# EAGLE design ATDevBoard (EAGLE 7.7.0)
VERSION: 1.1
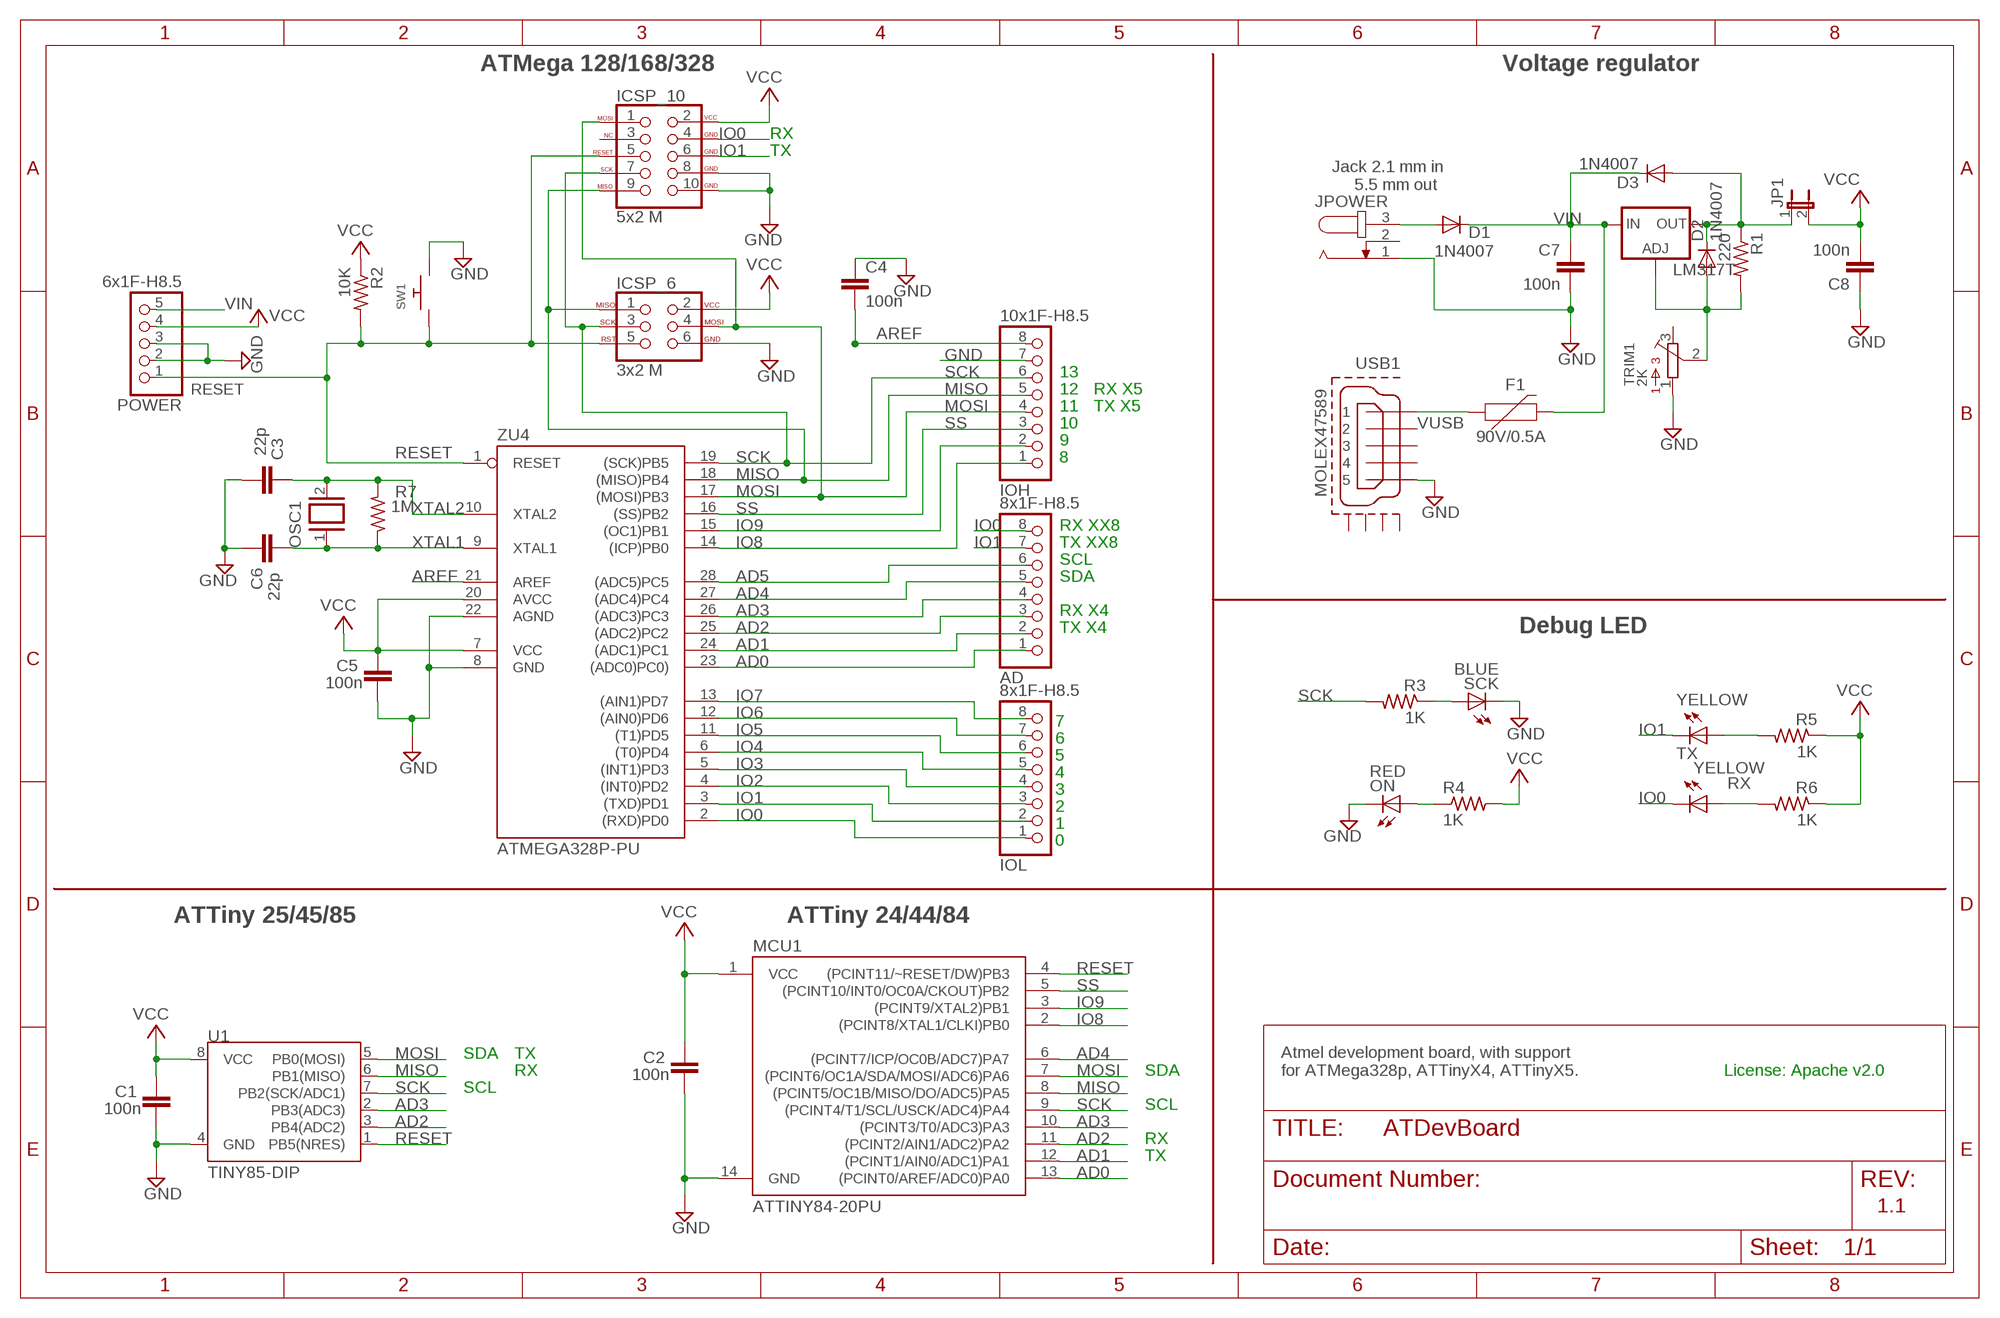
[diagram p0: schematic, sheet 1]

## Parts
AD  8x1F-H8.5  PINHD-1X8  [1X08]
C1  100n  C-EU050-024X044  [C050-024X044]
C2  100n  C-EU050-024X044  [C050-024X044]
C3  22p  C-EU050-024X044  [C050-024X044]
C4  100n  C-EU050-024X044  [C050-024X044]
C5  100n  C-EU050-024X044  [C050-024X044]
C6  22p  C-EU050-024X044  [C050-024X044]
C7  100n  C-EU050-024X044  [C050-024X044]
C8  100n  C-EU050-024X044  [C050-024X044]
D1  1N4007  1N4004  [DO41-10]
D2  1N4007  1N4004  [DO41-10]
D3  1N4007  1N4004  [DO41-10]
F1  90V/0.5A  PPTC_PTH  [PTH]
ICSP_6  3x2 M  AVR_SPI_PROG_3X2PTH  [2X3]
ICSP_10  5x2 M  AVR_SPI_PROG_5X2PTH2  [2X5-SHROUDED]
IOH  10x1F-H8.5  PINHD-1X8  [1X08]
IOL  8x1F-H8.5  PINHD-1X8  [1X08]
JP1  JP1E  [JP1]
JPOWER  JACK-PLUG0  [SPC4077]
LM317T  LM317TS  [317TS]
MCU1  ATTINY84-20PU  ATTINY84ATTINY84-20PU  [DIL14]
ON  RED  LEDCHIPLED_1206  [CHIPLED_1206]
OSC1  XTAL/S  [QS]
POWER  6x1F-H8.5  PINHD-1X5  [1X05]
R1  220  R-US_0204/7  [0204/7]
R2  10K  R-US_0309/12  [0309/12]
R3  1K  R-US_0207/10  [0207/10]
R4  1K  R-US_0207/10  [0207/10]
R5  1K  R-US_0207/10  [0207/10]
R6  1K  R-US_0207/10  [0207/10]
R7  1M  R-US_0309/12  [0309/12]
RX  YELLOW  LEDCHIPLED_1206  [CHIPLED_1206]
SCK  BLUE  LEDCHIPLED_1206  [CHIPLED_1206]
SW1  SWITCH_PUSHBUTTONEVQ-PE  [TACT_PANA-EVQ]
TRIM1  2K  3362R  [3362R]
TX  YELLOW  LEDCHIPLED_1206  [CHIPLED_1206]
U1  TINY85-DIP  ATTINY45TINY85-20-DIP  [DIP08]
USB1  MOLEX47589  MICRO-USB-RECEPTACLE47589-0001  [47589-0001]
ZU4  ATMEGA328P-PU  [DIL28-3]

## Nets
AD0: AD.1 MCU1.13((PCINT0/AREF/ADC0)PA0) ZU4.23((ADC0)PC0))
AD1: AD.2 MCU1.12((PCINT1/AIN0/ADC1)PA1) ZU4.24((ADC1)PC1)
AD2: AD.3 MCU1.11((PCINT2/AIN1/ADC2)PA2) U1.3(PB4(ADC2)) ZU4.25((ADC2)PC2)
AD3: AD.4 MCU1.10((PCINT3/T0/ADC3)PA3) U1.2(PB3(ADC3)) ZU4.26((ADC3)PC3)
AD4: AD.5 MCU1.6((PCINT7/ICP/OC0B/ADC7)PA7) ZU4.27((ADC4)PC4)
AD5: AD.6 ZU4.28((ADC5)PC5)
AREF [aref]: C4.2 IOH.8 ZU4.21(AREF)
GND [gnd]: C1.1 C2.1 C3.1 C4.1 C5.1 C6.2 C7.1 C8.1 ICSP_6.6 ICSP_10.8(GND) ICSP_10.10(GND) IOH.7 JPOWER.1 MCU1.14(GND) ON.C POWER.2 POWER.3 SCK.C SW1.P$2 TRIM1.1 U1.4(GND) USB1.5 ZU4.8(GND) ZU4.22(AGND)
IO0: AD.8 ICSP_10.4(GND) IOL.1 RX.C ZU4.2((RXD)PD0)
IO1: AD.7 ICSP_10.6(GND) IOL.2 TX.C ZU4.3((TXD)PD1)
IO2: IOL.3 ZU4.4((INT0)PD2)
IO3: IOL.4 ZU4.5((INT1)PD3)
IO4: IOL.5 ZU4.6((T0)PD4)
IO5: IOL.6 ZU4.11((T1)PD5)
IO6: IOL.7 ZU4.12((AIN0)PD6)
IO7: IOL.8 ZU4.13((AIN1)PD7)
IO8: IOH.1 MCU1.2((PCINT8/XTAL1/CLKI)PB0) ZU4.14((ICP)PB0)
IO9: IOH.2 MCU1.3((PCINT9/XTAL2)PB1) ZU4.15((OC1)PB1)
MISO: ICSP_6.1 ICSP_10.9(MISO) IOH.5 MCU1.8((PCINT5/OC1B/MISO/DO/ADC5)PA5) U1.6(PB1(MISO)) ZU4.18((MISO)PB4)
MOSI: ICSP_6.4 ICSP_10.1(MOSI) IOH.4 MCU1.7((PCINT6/OC1A/SDA/MOSI/ADC6)PA6) U1.5(PB0(MOSI)) ZU4.17((MOSI)PB3)
N$1 [aref]: D2.A LM317T.1(ADJ) R1.2 TRIM1.2
N$2 [power]: D1.A JPOWER.3
N$3: ON.A R4.1
N$4: R3.1 SCK.A
N$5 [vcc]: D2.C D3.A JP1.1 LM317T.2(OUT) R1.1
N$35: R6.2 RX.A
N$36: R5.2 TX.A
RESET: ICSP_6.5 ICSP_10.5(RESET) MCU1.4((PCINT11/~RESET/DW)PB3) POWER.1 R2.2 SW1.P$1 U1.1(PB5(NRES)) ZU4.1(RESET)
SCK: ICSP_6.3 ICSP_10.7(SCK) IOH.6 MCU1.9((PCINT4/T1/SCL/USCK/ADC4)PA4) R3.2 U1.7(PB2(SCK/ADC1)) ZU4.19((SCK)PB5)
SS: IOH.3 MCU1.5((PCINT10/INT0/OC0A/CKOUT)PB2) ZU4.16((SS)PB2)
VCC [vcc]: C1.2 C2.2 C5.2 C8.2 ICSP_6.2 ICSP_10.2(VCC) JP1.2 MCU1.1(VCC) POWER.4 R2.1 R4.2 R5.1 R6.1 U1.8(VCC) ZU4.7(VCC) ZU4.20(AVCC)
VIN [power]: C7.2 D1.C D3.C F1.P$2 LM317T.3(IN) POWER.5
VUSB: F1.P$1 USB1.1
XTAL1: C6.1 OSC1.1 R7.1 ZU4.9(XTAL1)
XTAL2: C3.2 OSC1.2 R7.2 ZU4.10(XTAL2)
Unconnected: ICSP_10.3(NC) JPOWER.2 TRIM1.3 USB1.2 USB1.3 USB1.4 USB1.CASING1(GND1) USB1.CASING2(GND2) USB1.CASING3(GND3) USB1.CASING4(GND4)

## Notes on the sheet
- ATMega 128/168/328 | Voltage regulator
- RX
- TX
- Jack 2.1 mm in 
       5.5 mm out
- 13
- 12 | RX X5
- 11 | TX X5
- 10
- 9
- 8
- RX XX8
- TX XX8
- SCL
- SDA
- RX X4
- TX X4 | Debug LED
- 7
- 6
- 5
- 4
- 3
- 2
- 1
- 0
- ATTiny 25/45/85 | ATTiny 24/44/84
- SDA | TX
- RX | SDA
- Atmel development board, with support
  for ATMega328p, ATTinyX4, ATTinyX5.
- License: Apache v2.0
- SCL
- SCL
- RX
- TX

## Library data of the parts
AD IOH IOL = pinhead:PINHD-1X8: PIN HEADER
C1-C6 = SmartPrj:C-EU: CAPACITOR, European symbol
C7 C8 = rcl:C-EU: CAPACITOR, European symbol
D1-D3 = diode:1N4004: DIODE general purpose rectifier, 1 A
F1 = SparkFun-Fuses:PPTC: Resettable Fuse PPTC Resettable Fuse. Really a sort of resistor with a polymeric positive temperature coefficient whose resistance increases dramatically with an increase in temperature. When heated by the power passing through the resistance rises causing the current to be limited, protecting the circuit. This is achieved by the transition of the polymer from a crystalline to an amorphous state where the conductive carbon separates breaking the conductive pathways found in the cool crystalline structure. When a PPTC cools back down it resumes conducting letting the circuit turn back on. SparkFun Products: SparkFun RedBoard - Programmed with Arduino <https://www.sparkfun.com/products/12757> Pro Micro - 5V/16MHz <https://www.sparkfun.com/products/12640> Arduino Pro 328 - 5V/16MHz <https://www.sparkfun.com/products/10915> MP3 Trigger <https://www.sparkfun.com/products/13720>; PROD_ID: RES-08490; VALUE: 72V/0.25A
ICSP_6 = SparkFun-Connectors:AVR_SPI_PROG_3X2: AVR ISP 6 Pin This is the reduced ISP connector for AVR programming. Common on Arduino. This footprint will take up less PCB space and can be used with a 10-pin to 6-pin adapter such as SKU: BOB-08508 **Special note about "TEST_POINT" package. The stop mask is on the top side, so if you want your programming test points to be on the bottom of your board, make sure to place this package on the bottom side of the board. This also ensure that the orientation to program from the bottom side will be correct. SparkFun Products: SparkFun ISP Pogo Adapter <https://www.sparkfun.com/products/11591> - NS Tiny AVR Programmer <https://www.sparkfun.com/products/11801> -PTH
ICSP_10 = SparkFun-Connectors:AVR_SPI_PROG_5X2: AVR 10-pin ICSP Header This is the standard AVR In Circuit Serial Programming header. Minimal, but includes pin one indicator. Works with standard Olimex programmers. SparkFun Products: 2x5 AVR ICSP Male Header <https://www.sparkfun.com/products/778> - PTH 2x5 Pin Shrouded Header <https://www.sparkfun.com/products/8506> - PTH2; PROD_ID: CONN-08671; SF_ID: PRT-08506
JP1 = jumper:JP1E: JUMPER
JPOWER = CuSTOM_GB:JACK-PLUG: DC POWER JACK Power Jack, DC, Right Angle, Through Hole, Rated 5A at 16VDC, PC Terminals Distributor: Farnell (www.Farnell.de) Drawing: 84N1161.pdf / 84N1162.pdf Manufacturer: SPC Technology (www.spctechnology.com) Type: SPC4077 / SPC 4078; OC_FARNELL: unknown; OC_NEWARK: unknown
LM317T = v-reg:LM317TS: VOLTAGE REGULATOR
MCU1 = SparkFun-DigitalIC:ATTINY84: Atmel 14-pin 2/4/8kB flash uC
ON RX SCK TX = led:LED: LED OSRAM: - CHIPLED LG R971, LG N971, LY N971, LG Q971, LY Q971, LO R971, LY R971 LH N974, LH R974 LS Q976, LO Q976, LY Q976 LO Q996 - Hyper CHIPLED LW Q18S LB Q993, LB Q99A, LB R99A - SideLED LS A670, LO A670, LY A670, LG A670, LP A670 LB A673, LV A673, LT A673, LW A673 LH A674 LY A675 LS A676, LA A676, LO A676, LY A676, LW A676 LS A679, LY A679, LG A679 - Hyper Micro SIDELED® LS Y876, LA Y876, LO Y876, LY Y876 LT Y87S - SmartLED LW L88C, LW L88S LB L89C, LB L89S, LG L890 LS L89K, LO L89K, LY L89K LS L896, LA L896, LO L896, LY L896 - TOPLED LS T670, LO T670, LY T670, LG T670, LP T670 LSG T670, LSP T670, LSY T670, LOP T670, LYG T670 LG T671, LOG T671, LSG T671 LB T673, LV T673, LT T673, LW T673 LH T674 LS T676, LA T676, LO T676, LY T676, LB T676, LH T676, LSB T676, LW T676 LB T67C, LV T67C, LT T67C, LS T67K, LO T67K, LY T67K, LW E67C LS E67B, LA E67B, LO E67B, LY E67B, LB E67C, LV E67C, LT E67C LW T67C LS T679, LY T679, LG T679 LS T770, LO T770, LY T770, LG T770, LP T770 LB T773, LV T773, LT T773, LW T773 LH T774 LS E675, LA E675, LY E675, LS T675 LS T776, LA T776, LO T776, LY T776, LB T776 LHGB T686 LT T68C, LB T68C - Hyper Mini TOPLED® LB M676 - Mini TOPLED Santana® LG M470 LS M47K, LO M47K, LY M47K Source: http://www.osram.convergy.de LUXEON: - LUMILED® LXK2-PW12-R00, LXK2-PW12-S00, LXK2-PW14-U00, LXK2-PW14-V00 LXK2-PM12-R00, LXK2-PM12-S00, LXK2-PM14-U00 LXK2-PE12-Q00, LXK2-PE12-R00, LXK2-PE12-S00, LXK2-PE14-T00, LXK2-PE14-U00 LXK2-PB12-K00, LXK2-PB12-L00, LXK2-PB12-M00, LXK2-PB14-N00, LXK2-PB14-P00, LXK2-PB14-Q00 LXK2-PR12-L00, LXK2-PR12-M00, LXK2-PR14-Q00, LXK2-PR14-R00 LXK2-PD12-Q00, LXK2-PD12-R00, LXK2-PD12-S00 LXK2-PH12-R00, LXK2-PH12-S00 LXK2-PL12-P00, LXK2-PL12-Q00, LXK2-PL12-R00 Source: www.luxeon.com KINGBRIGHT: KA-3528ASYC Source: www.kingbright.com
OSC1 = special:XTAL/S: CRYSTAL
POWER = pinhead:PINHD-1X5: PIN HEADER
R1-R7 = rcl:R-US_: RESISTOR, American symbol
SW1 = adafruit:SWITCH_PUSHBUTTON: Buttons SOFTTOUCHSMD_SJ - Soft touch temporary push button (Super Junk Akihabara) Compatible with SKPMANE010 [Mouser: 688-SKPMAN] C&K_KSS = Digikey: KSS221GLFS
TRIM1 = bourns:3362: 3362 Series 1/4" Square Trimmer
U1 = SparkFun-DigitalIC:ATTINY45: Atmel 8-pin 2/4/8kB flash uC; PROD_ID: IC-09445; VALUE: TINY85-20-DIP
USB1 = CuSTOM_GB:MICRO-USB-RECEPTACLE: MICRO USB RECEPTACLES Micro-USB Receptacles, SMT, Lead-Free from MOLEX <http://www.molex.com/>. (C) 2014 Tomasz Boleslaw CEDRO, cederom@tlen.pl, http://www.tomek.cedro.info. Version 0.1 (2014-01-17): Initial release. Version 0.2 (2014-02-06): Updated 47589-0001 footprint pins/pads/milling. Following devices are included: 1. 47589-0001 Micro-USB AB Receptacle, Bottom Mount, SMT, Lead-Free <http://www.molex.com/molex/products/datasheet.jsp?part=active/0475890001_IO_CONNECTORS.xml> (Technical Drawing <http://www.molex.com/pdm_docs/sd/475890001_sd.pdf>).
ZU4 = SmartPrj:ATMEGA328P-: MICROCONTROLLER 4 Kbytes FLASH 128 bytes SRAM 256 bytes EEPROM UART 6-channel 10 bit ADC

## Net classes
0 default: width 0.254 mm, clearance 0.254 mm
1 power: width 0.61 mm, drill 0.508 mm, clearance 0.254 mm
2 gnd: width 0.406 mm, drill 0.508 mm, clearance 0.127 mm
3 aref: width 0.406 mm, drill 0.508 mm, clearance 0.254 mm
4 usbvcc: width 0.406 mm, drill 0.508 mm, clearance 0.254 mm
5 vcc: width 0.406 mm, drill 0.508 mm, clearance 0.254 mm

## Board
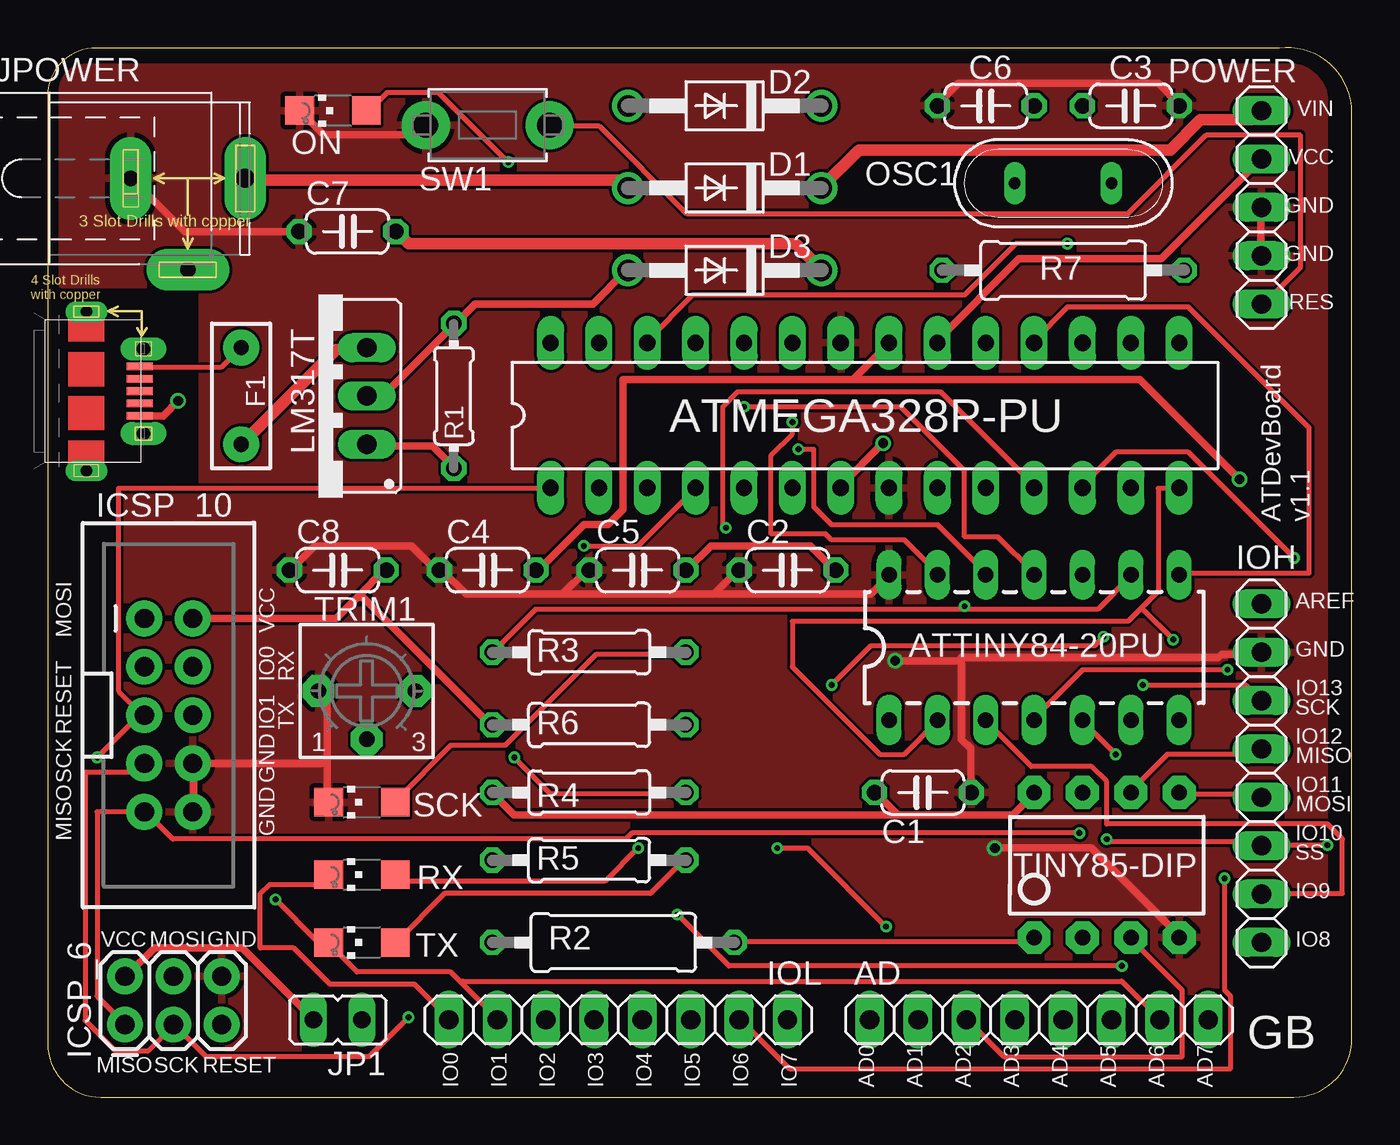
[diagram p1: board, top side]
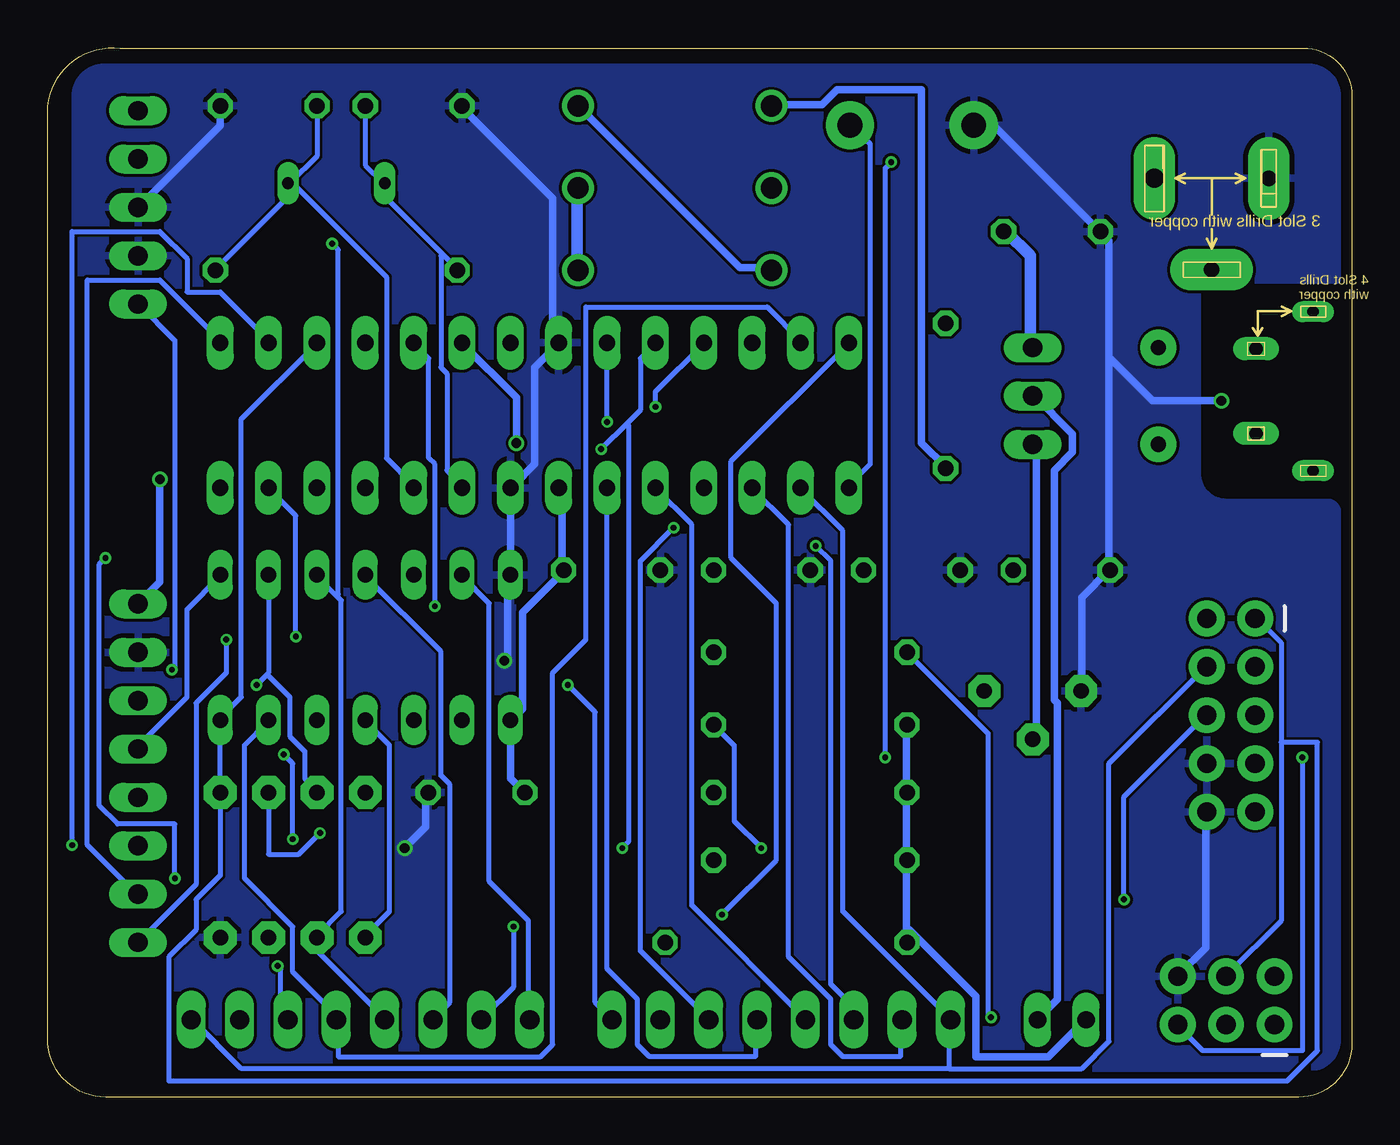
[diagram p2: board, bottom side, seen from below]

Size 68.5 x 55.13 mm. Coordinates in mm from the lower left corner, seen from the top.
Outline: 0,52.57 0,2.79 arc90 2.79,0 65.46,0 arc90 68.5,3.05 68.5,52.06 arc90 64.69,55.11 2.54,55.11 arc90 0,52.57
Copper layers (1*16): Top 0.035mm / dielectric 1.5mm / Bottom 0.035mm
Design rules "SeeedStudio_2layer_DRU_no_angle_20140221": minimum track width 6mil, minimum drill 12mil, track to track 6mil, track to pad 6mil, pad to pad 6mil, via to via 6mil, smd to smd 0mil, copper to edge 10mil, drill to drill 10mil, minimum pad ring 10mil, minimum via ring 6mil, stop-mask expansion 2mil, vias tented up to drill 100mil, thermal gap 10mil

### Footprints (pad centres in the part's own frame; a part is rotated, then mirrored left to right if it is on the bottom)
1X08 = drill 1.016 long: 1 -8.89,0; 2 -6.35,0; 3 -3.81,0; 4 -1.27,0; 5 1.27,0; 6 3.81,0; 7 6.35,0; 8 8.89,0
C050-024X044 = drill 0.813 octagon: 1 -2.54,0; 2 2.54,0
DO41-10 = drill 1.118: A 5.08,0; C -5.08,0
PTH = drill 0.8 pad 1.88: P$1 -2.54,0; P$2 2.54,0
2X3 = drill 1.016 pad 1.88: 1 0,0; 2 0,2.54; 3 2.54,0; 4 2.54,2.54; 5 5.08,0; 6 5.08,2.54
2X5-SHROUDED = drill 1.016 pad 1.88: 1 -1.27,5.08; 2 1.27,5.08; 3 -1.27,2.54; 4 1.27,2.54; 5 -1.27,0; 6 1.27,0; 7 -1.27,-2.54; 8 1.27,-2.54; 9 -1.27,-5.08; 10 1.27,-5.08
JP1 = drill 0.914 long: 1 0,-1.27; 2 0,1.27
SPC4077 = drill 0.8 pad 2.184 long: 1 -3,0; 2 0,-4.8 | drill 1 pad 2.184 long: 3 3,0
317TS = drill 1.016 long: 1 -2.54,-2.54; 2 0,-2.54; 3 2.54,-2.54
DIL14 = drill 0.813 long: 1 -8.89,-3.81; 2 -6.35,-3.81; 3 -3.81,-3.81; 4 -1.27,-3.81; 5 1.27,-3.81; 6 3.81,-3.81; 7 6.35,-3.81; 8 6.35,3.81; 9 3.81,3.81; 10 1.27,3.81; 11 -1.27,3.81; 12 -3.81,3.81; 13 -6.35,3.81; 14 -8.89,3.81
CHIPLED_1206 = smd 1.5 x 1.5: A 0,-1.75; C 0,1.75
QS = drill 0.61 long: 1 -2.54,0; 2 2.54,0
1X05 = drill 1.016 long: 1 -5.08,0; 2 -2.54,0; 3 0,0; 4 2.54,0; 5 5.08,0
0204/7 = drill 0.813 octagon: 1 -3.81,0; 2 3.81,0
0309/12 = drill 0.813 octagon: 1 -6.35,0; 2 6.35,0
0207/10 = drill 0.813 octagon: 1 -5.08,0; 2 5.08,0
TACT_PANA-EVQ = drill 1.3 pad 2.54: P$1 -3.25,0; P$2 3.25,0
3362R = drill 0.813 pad 1.676 octagon: 1 -2.54,0; 2 0,-2.54; 3 2.54,0
DIP08 = drill 0.813 pad 1.727 octagon: 1 -3.81,-3.81; 2 -1.27,-3.81; 3 1.27,-3.81; 4 3.81,-3.81; 5 3.81,3.81; 6 1.27,3.81; 7 -1.27,3.81; 8 -3.81,3.81
47589-0001 = smd 1.35 x 0.4: 1 2.8,1.3; 2 2.8,0.65; 3 2.8,0; 4 2.8,-0.65; 5 2.8,-1.3 | drill 0.6 pad 0.95 long: CASING1 0,4.175; CASING2 0,-4.175 | drill 0.7 pad 1.1 long: CASING3 3,2.225; CASING4 3,-2.225
DIL28-3 = drill 0.85 pad 1.422 long: 1 -16.51,-3.81; 2 -13.97,-3.81; 3 -11.43,-3.81; 4 -8.89,-3.81; 5 -6.35,-3.81; 6 -3.81,-3.81; 7 -1.27,-3.81; 8 1.27,-3.81; 9 3.81,-3.81; 10 6.35,-3.81; 11 8.89,-3.81; 12 11.43,-3.81; 13 13.97,-3.81; 14 16.51,-3.81; 15 16.51,3.81; 16 13.97,3.81; 17 11.43,3.81; 18 8.89,3.81; 19 6.35,3.81; 20 3.81,3.81; 21 1.27,3.81; 22 -1.27,3.81; 23 -3.81,3.81; 24 -6.35,3.81; 25 -8.89,3.81; 26 -11.43,3.81; 27 -13.97,3.81; 28 -16.51,3.81

### Placement (x,y rotation side)
AD  52.07,4.06 0 top
C1  45.97,16 180 top
C2  38.86,27.69 0 top
C3  56.9,52.07 180 top
C4  23.11,27.69 0 top
C5  30.99,27.69 0 top
C6  49.28,52.07 180 top
C7  15.75,45.47 0 top
C8  15.24,27.69 0 top
D1  35.56,47.75 180 top
D2  35.56,52.07 180 top
D3  35.56,43.43 180 top
F1  10.16,36.83 270 top
ICSP_6  4.06,3.81 0 top
ICSP_10  6.35,20.07 0 top
IOH  63.75,17.02 90 top
IOL  29.97,4.06 0 top
JP1  15.24,4.06 90 top
JPOWER  7.37,48.26 0 top
LM317T  14.22,36.83 90 top
MCU1  53.09,23.62 0 top
ON  14.99,51.82 90 top
OSC1  53.34,48.01 0 top
POWER  63.75,46.74 90 top
R1  21.34,36.83 270 top
R2  29.72,8.13 0 top
R3  28.45,23.37 180 top
R4  28.45,16 180 top
R5  28.45,12.45 0 top
R6  28.45,19.56 0 top
R7  53.34,43.43 0 top
RX  16.51,11.68 90 top
SCK  16.51,15.49 90 top
SW1  23.11,51.05 180 top
TRIM1  16.76,21.34 0 top
TX  16.51,8.13 90 top
U1  55.63,12.19 0 top
USB1  2.03,37.08 0 top
ZU4  42.93,35.81 0 top

### Tracks (layer width: path | path; a pad name or v marks a point on that pad's centre or on a via)
AD0  (via drill 0.3)
  Top 0.254: v39.12,35.47 39.12,34.83 38.01,33.72 38.01,29.59 40.86,29.59 41.18,29.27 44.99,29.27 46.74,27.53 MCU1.13
  Bottom 0.254: MCU1.13 46.74,27.37 45.31,25.94 45.31,11.34 43.24,9.27 43.24,4.19 AD.1 | v39.12,35.47 ZU4.23
AD1  (via drill 0.3)
  Top 0.254: v39.43,34.04 40.23,34.04 40.23,31.02 41.18,30.07 46.74,30.07 49.28,27.53 MCU1.12 | v44.04,8.95 39.91,13.08 v38.32,13.08
  Bottom 0.254: 38.08,35.39 37.37,36.1 37.37,38.8 36.58,39.59 ZU4.24 | 38.08,35.39 v39.43,34.04 | v44.04,8.95 44.04,5.78 45.62,4.19 AD.2 | v38.32,13.08 38.01,13.4 38.01,35.31 38.08,35.39
AD2  (via drill 0.3)
  Top 0.254: v36.58,36.26 44.83,36.26 48.16,32.93 48.16,29.43 49.91,29.43 51.82,27.53 MCU1.11 | U1.3 56.9,8.32 59.59,5.62 59.59,2.13 50.23,2.13 48.32,4.03 AD.3
  Bottom 0.254: MCU1.11 51.82,27.37 47.85,23.4 47.85,16.89 47.37,16.41 47.37,4.98 48.16,4.19 AD.3 | v36.58,36.26 36.58,37.05 34.04,39.59 ZU4.25
AD3  (via drill 0.3)
  Top 0.254: v53.56,44.83 50.86,44.83 48.16,42.13 33.88,42.13 31.5,39.75 ZU4.26
  Bottom 0.254: 53.32,26.34 53.09,26.1 53.09,9.75 54.36,8.48 U1.2 54.36,7.68 50.86,4.19 AD.4 | 53.32,26.34 54.36,27.37 MCU1.10 | v53.56,44.83 53.25,44.51 53.25,26.42 53.32,26.34
AD4
  Bottom 0.254: MCU1.6 56.9,19.75 58.17,18.48 58.17,11.49 55.63,8.95 55.63,6.57 53.4,4.35 53.4,4.19 AD.5 53.25,4.03 53.25,2.13 42.61,2.13 41.97,2.76 41.97,22.29 40.23,24.04 40.23,41.5 30.7,41.5 28.96,39.75 ZU4.27
AD5  (via drill 0.3)
  Top 0.254: v33.08,9.59 35.78,6.89 v56.42,6.89
  Bottom 0.254: v33.08,9.59 30.23,12.45 30.23,25.94 32.61,28.32 32.61,33.4 26.42,39.59 ZU4.28 | v56.42,6.89 56.26,6.73 56.26,4.51 55.94,4.19 AD.6
AREF  (via drill 0.51)
  Top 0.406: 42.29,37.69 30.23,37.69 30.23,30.86 29.43,30.07 28.16,30.07 25.78,27.69 C4.2 | 42.29,37.69 44.2,39.59 ZU4.21 | v62.61,32.45 57.37,37.69 42.29,37.69
  Bottom 0.406: IOH.8 62.61,27.05 v62.61,32.45
GND  (via drill 0.51)
  Top 0.406: ON.C 14.51,50.55 19.27,50.55 19.75,51.02 SW1.P$2 | C7.1 7.21,45.47 4.51,48.16 JPOWER.1 | 14.67,17.53 14.67,21.34 TRIM1.1 | 14.67,17.53 14.67,15.62 SCK.C | ICSP_10.10 7.68,14.99 7.68,17.53 ICSP_10.8 14.67,17.53 | 48.01,22.92 48.01,23.08 61.5,23.08 61.66,23.24 63.72,23.24 IOH.7 | 48.01,22.92 48.01,18.8 48.48,18.32 48.48,16.1 C1.1 | v49.75,13.08 54.83,13.08 59.44,8.48 U1.4 | POWER.2 63.72,44.2 63.72,46.74 POWER.3 | C6.2 46.74,52.13 47.85,53.25 58.33,53.25 59.44,52.13 C3.1 | 27.05,26.42 21.97,26.42 20.7,27.69 C4.1 20.38,27.69 19.11,28.96 14.03,28.96 12.76,27.69 C8.1 | 27.05,26.42 28.32,27.69 C5.1 | 35.07,26.49 34.99,26.42 27.05,26.42 | 35.07,26.49 36.26,27.69 C2.1 | MCU1.14 44.2,27.37 43.24,26.42 35.15,26.42 35.07,26.49 | v44.51,22.92 48.01,22.92 | USB1.5 6.07,35.78 v6.86,36.58
  Bottom 0.406: SW1.P$2 19.75,51.02 18.8,51.02 13.24,45.47 C7.1 13.08,45.31 12.76,44.99 12.76,38.86 | TRIM1.1 14.19,21.34 14.19,26.26 12.76,27.69 C8.1 12.76,27.84 12.76,38.86 | ICSP_6.6 9.11,6.41 7.68,7.84 7.68,14.99 ICSP_10.10 | v49.75,13.08 48.64,14.19 48.64,15.94 C1.1 | C3.1 59.44,51.02 63.72,46.74 POWER.3 | C6.2 46.74,51.98 41.97,47.21 41.97,39.43 ZU4.22 41.66,39.59 42.93,38.32 42.93,33.24 44.04,32.13 ZU4.8 MCU1.14 44.36,27.37 44.36,23.08 v44.51,22.92 | v6.86,36.58 10.48,36.58 12.76,38.86
  pour Bottom: 0.76,42.93 0.76,52.58 arc-90 2.29,54.1 65.53,54.1 arc-90 67.06,52.58 67.06,3.56 arc-90 65.02,1.52 2.29,1.52 arc-90 0.76,3.05 0.76,30.73 arc-90 1.27,31.24 6.6,31.24 arc90 8.13,32.77 8.13,42.42 arc90 7.62,42.93
  pour Top: 0.76,42.93 0.76,52.83 arc-90 2.03,54.1 65.28,54.1 arc-90 67.06,52.32 67.06,3.05 arc-90 65.28,1.27 3.05,1.27 arc-90 0.76,3.56 0.76,31.24 arc-90 1.02,31.5 7.62,31.5 arc90 8.13,32 8.13,42.67 0.76,42.67
IO0
  Top 0.254: RX.C 14.67,11.65 14.19,11.18 11.65,11.18 11.18,10.7 11.18,7.84 12.92,7.84 14.83,5.94 19.27,5.94 21.02,4.19 IOL.1
  Bottom 0.254: ZU4.2 28.96,31.97 26.73,29.75 26.73,9.75 21.18,4.19 IOL.1 21.18,4.03 21.18,1.49 | 21.18,1.49 58.33,1.49 60.87,4.03 AD.8 | 21.18,1.49 14.19,1.49 12.76,2.92 12.76,17.53 7.68,22.61 ICSP_10.4
IO1  (via drill 0.3)
  Top 0.254: 21.73,6.02 23.56,4.19 IOL.2 | 21.73,6.02 21.18,6.57 16.26,6.57 14.83,8 TX.C 14.67,8.16 14.19,8.16 v11.97,10.38 | AD.7 58.33,4.19 56.42,6.1 21.81,6.1 21.73,6.02
  Bottom 0.254: ZU4.3 31.5,31.97 29.59,30.07 29.59,7.37 27.37,5.14 27.37,2.76 26.73,2.13 23.72,2.13 23.72,4.03 IOL.2 | v11.97,10.38 11.97,15.78 7.68,20.07 ICSP_10.6
IO2  (via drill 0.3)
  Top 0.254: v28.16,28.96 31.02,28.96 34.04,31.97 ZU4.4
  Bottom 0.254: v28.16,28.96 27.37,28.16 27.37,5.94 26.26,4.83 26.26,4.19 IOL.3
IO3
  Bottom 0.254: ZU4.5 36.58,31.97 34.67,30.07 34.67,10.07 28.8,4.19 IOL.4
IO4
  Bottom 0.254: ZU4.6 39.12,6.73 37.53,5.14 37.53,2.76 36.89,2.13 31.34,2.13 31.34,4.03 IOL.5
IO5  (via drill 0.3)
  Top 0.254: v35.62,29.91 35.47,29.91 35.47,36.26 36.26,37.05 46.9,37.05 51.82,32.13 ZU4.11
  Bottom 0.254: v35.62,29.91 37.37,28.16 37.37,7.68 33.88,4.19 IOL.6
IO6  (via drill 0.3)
  Top 0.254: v65.47,28.32 59.91,33.88 56.1,33.88 54.36,32.13 ZU4.12 | v61.82,11.49 61.82,5.62 62.14,5.3 62.14,1.49 38.96,1.49 36.42,4.03 IOL.7
  Bottom 0.254: v65.47,28.32 65.79,28 65.79,15.3 64.83,14.35 61.82,14.35 v61.82,11.49
IO7  (via drill 0.3)
  Top 0.254: v55.47,24.19 54.99,23.72 43.24,23.72 v41.18,21.65
  Bottom 0.254: v55.47,24.19 55.47,30.54 56.9,31.97 ZU4.13 | v41.18,21.65 39.75,20.22 39.75,4.98 38.96,4.19 IOL.8
IO8  (via drill 0.3)
  Top 0.254: 57.45,25.7 58.33,26.57 58.33,31.97 59.44,31.97 ZU4.14 | 57.45,25.7 56.74,24.99 39.12,24.99 39.12,22.61 43.72,18 44.99,18 46.74,19.75 MCU1.2 | 57.45,25.7 v59.12,24.04
  Bottom 0.254: IOH.1 60.71,11.18 60.71,20.7 59.12,22.29 v59.12,24.04
IO9
  Top 0.254: MCU1.3 49.28,19.75 51.66,17.37 54.83,17.37 55.63,16.57 55.63,14.35 67.21,14.35 68.01,13.56 68.01,10.7 63.88,10.7 IOH.2
  Bottom 0.254: ZU4.15 59.44,39.75 62.61,42.93 66.42,42.93 66.42,13.24 63.88,10.7 IOH.2
MISO  (via drill 0.3)
  Top 0.254: ICSP_6.1 4.03,3.87 2.6,5.3 2.6,14.99 ICSP_10.9 5.14,14.99 6.57,13.56 30.38,13.56 30.7,13.88 v54.2,13.88 | ZU4.18 51.82,39.75 53.56,41.5 59.91,41.5 66.26,35.15 66.26,27.53 59.44,27.53 MCU1.8 | U1.6 56.9,16.1 58.8,18 63.56,18 63.72,18.16 IOH.5
  Bottom 0.254: MCU1.8 59.44,27.37 61.18,25.62 61.18,21.02 63.72,18.48 63.72,18.32 IOH.5 | v54.2,13.88 55.31,12.76 56.9,12.76 U1.6
MOSI
  Top 0.254: IOH.4 63.56,15.94 59.44,15.94 U1.5
  Bottom 0.254: 3.71,18.64 3.71,23.88 4.98,25.15 ICSP_10.1 | 3.71,18.64 3.71,9.27 6.57,6.41 ICSP_6.4 | ZU4.17 54.36,39.59 58.33,35.62 58.33,21.02 59.44,19.91 MCU1.7 U1.5 59.44,11.65 60.71,10.38 60.71,8.79 62.14,7.37 62.14,0.86 3.4,0.86 1.81,2.44 1.81,18.64 3.71,18.64
N$1
  Top 0.406: R1.2 21.34,33.08 20.22,34.2 16.89,34.2 LM317T.1
  Bottom 0.406: TRIM1.2 16.73,18.8 16.57,18.95 16.57,34.04 16.73,34.2 LM317T.1 | D2.A 30.38,52.13 27.84,52.13 27.05,52.93 22.61,52.93 22.61,34.35 21.34,33.08 R1.2
N$2
  Top 0.61: D1.A 30.07,48.16 10.38,48.16 JPOWER.3
N$3  (via drill 0.3)
  Top 0.254: v24.19,49.12 20.54,52.77 17.84,52.77 16.89,51.82 ON.A | v24.51,17.84 26.42,15.94 33.4,15.94 R4.1
  Bottom 0.254: v24.19,49.12 24.51,48.8 v24.51,17.84
N$4
  Top 0.254: SCK.A 18.32,15.62 21.18,18.48 24.04,18.48 28.8,23.24 33.4,23.24 R3.1
N$5
  Top 0.406: LM317T.2 16.89,36.89 17.68,36.89 21.34,40.55 R1.1 21.49,40.7 22.45,41.66 28.64,41.66 30.38,43.4 D3.A
  Bottom 0.406: JP1.1 16.41,4.19 15.46,5.14 15.46,20.7 15.62,20.86 15.62,32.93 14.67,33.88 14.67,34.83 16.73,36.89 LM317T.2 | D2.C 32.13,43.56 30.54,43.56 D3.A
N$35  (via drill 0.3)
  Top 0.254: v31.02,13.08 29.27,11.34 18.64,11.34 18.32,11.65 RX.A
  Bottom 0.254: v31.02,13.08 32.45,14.51 32.45,18.48 R6.2
N$36
  Top 0.254: TX.A 18.32,8.16 20.86,10.7 31.65,10.7 33.4,12.45 R5.2
RESET  (via drill 0.3)
  Top 0.254: R2.2 36.1,8.16 51.66,8.16 51.82,8.32 U1.1 | POWER.1 63.88,41.66 65.79,43.56 65.79,50.55 60.87,50.55 56.74,46.42 33.56,46.42 28.96,51.02 26.42,51.02 SW1.P$1 | ZU4.1 26.42,31.97 3.71,31.97 3.71,21.34 4.98,20.07 ICSP_10.5 4.83,20.07 v2.6,17.84 | v61.98,22.45 54.36,22.45 51.82,19.91 MCU1.4
  Bottom 0.254: MCU1.4 51.82,19.75 50.55,18.48 50.55,9.75 51.82,8.48 U1.1 | ZU4.1 26.42,32.13 25.3,33.24 25.3,50.07 26.26,51.02 SW1.P$1 | v2.6,17.84 2.6,2.44 7.84,2.44 9.11,3.71 ICSP_6.5 | v61.98,22.45 61.82,22.61 61.82,39.75 63.72,41.66 POWER.1
SCK  (via drill 0.3)
  Top 0.254: ICSP_10.7 4.98,17.53 4.51,17.05 1.97,17.05 1.97,4.03 3.56,2.44 5.3,2.44 6.57,3.71 ICSP_6.3 6.73,3.71 8.32,2.13 16.89,2.13 v18.95,4.19 | R3.2 25.62,25.62 48.16,25.62 | 48.16,25.62 55.15,25.62 56.9,27.37 MCU1.9 | 48.16,25.62 v48.16,25.78 | IOH.6 62.93,21.65 v57.53,21.65
  Bottom 0.254: v48.16,25.78 48.16,33.24 48.48,33.56 48.48,38.8 49.28,39.59 ZU4.19 | 56.98,22.21 56.9,22.29 MCU1.9 | 56.98,22.21 v57.53,21.65 | 56.98,22.21 55.79,21.02 55.79,18.95 54.99,18.16 54.99,16.73 54.36,16.1 U1.7 | v18.95,4.19 19.11,4.35 19.11,19.11 R3.2
SS  (via drill 0.3)
  Top 0.254: v56.1,18 54.36,19.75 MCU1.5 | v55.63,13.56 55.79,13.4 63.56,13.4 IOH.3 63.88,13.24 v67.21,13.24
  Bottom 0.254: v56.1,18 55.63,17.53 v55.63,13.56 | v67.21,13.24 67.21,45.47 62.61,45.47 61.18,44.04 61.18,42.29 59.44,42.29 56.9,39.75 ZU4.16
VCC  (via drill 0.51)
  Top 0.406: JP1.2 13.88,4.19 10.22,7.84 5.62,7.84 4.19,6.41 ICSP_6.2 | 16.33,26.34 15.14,25.15 ICSP_10.2 | 16.33,26.34 17.68,27.69 C8.2 | R6.1 23.24,19.59 16.57,26.26 16.41,26.26 16.33,26.34 | ZU4.20 46.74,39.75 51.02,44.04 58.48,44.04 63.72,49.28 POWER.4 | C5.2 33.56,27.69 34.83,28.96 40.07,28.96 41.34,27.69 C2.2 | 44.67,14.83 50.71,14.83 51.82,15.94 U1.8 | 44.67,14.83 43.56,15.94 C1.2 | v43.88,34.35 41.66,32.13 ZU4.7 | 44.67,14.83 24.51,14.83 23.4,15.94 R4.2
  Bottom 0.406: R6.1 23.4,19.43 23.4,16.1 R4.2 23.4,15.94 23.4,12.61 R5.1 23.4,12.45 23.4,8.79 | 23.4,8.79 23.4,8.16 R2.1 | JP1.2 14.03,4.03 15.94,2.13 19.75,2.13 19.75,5.3 23.24,8.79 23.4,8.79 | ZU4.7 41.66,31.97 41.5,31.81 41.5,27.69 C2.2 41.5,27.53 43.56,25.46 43.56,20.38 44.04,19.91 MCU1.1 44.2,16.73 43.56,16.1 C1.2 | v43.88,34.35 43.88,36.73 46.74,39.59 ZU4.20
VIN
  Top 0.61: F1.P$2 15.14,39.28 16.73,39.28 LM317T.3 | POWER.5 63.72,51.82 63.25,51.34 60.55,51.34 58.96,49.75 42.61,49.75 40.7,47.85 D1.C | C7.2 18.32,45.47 18.95,44.83 39.28,44.83 40.55,43.56 D3.C
  Bottom 0.61: C7.2 18.16,45.47 16.89,44.2 16.89,39.43 LM317T.3 | D3.C 40.7,43.56 40.7,47.69 D1.C
VUSB
  Top 0.254: F1.P$1 9.11,38.32 4.98,38.32 USB1.1
XTAL1
  Bottom 0.254: C6.1 51.82,48.96 50.86,48.01 OSC1.1 50.71,48.01 50.71,47.21 47.77,44.28 | 47.77,44.28 47.05,43.56 R7.1 | ZU4.9 46.74,32.13 47.53,32.93 47.53,38.01 47.85,38.32 47.85,44.2 47.77,44.28
XTAL2
  Bottom 0.254: C3.2 54.36,49.44 55.79,48.01 OSC1.2 | R7.2 59.59,43.56 55.94,47.21 55.94,48.01 OSC1.2 | ZU4.10 49.28,32.13 50.71,33.56 50.71,43.09 55.63,48.01 OSC1.2

### Text on the board
tNames: VIN | VCC | GND | GND | RES | ATDevBoard / v1.1 | AREF | VCC | MOSI | GND | IO0 | RX | IO13 | IO1 | TX | SCK | RESET | IO12 | MISO | SCK | GND | IO11 | MOSI | MISO | GND | IO10 | SS | IO9 | VCC | MOSI | GND | IO8 | GB | MISO | SCK | RESET | IO0 | IO1 | IO2 | IO3 | IO4 | IO5 | IO6 | IO7 | AD0 | AD1 | AD2 | AD3 | AD4 | AD5 | AD6 | AD7